# Altium schematic sheet VCU-S02-V00-12VProtection.schdoc
size A3; SheetNumber: 2; SheetTotal: 25
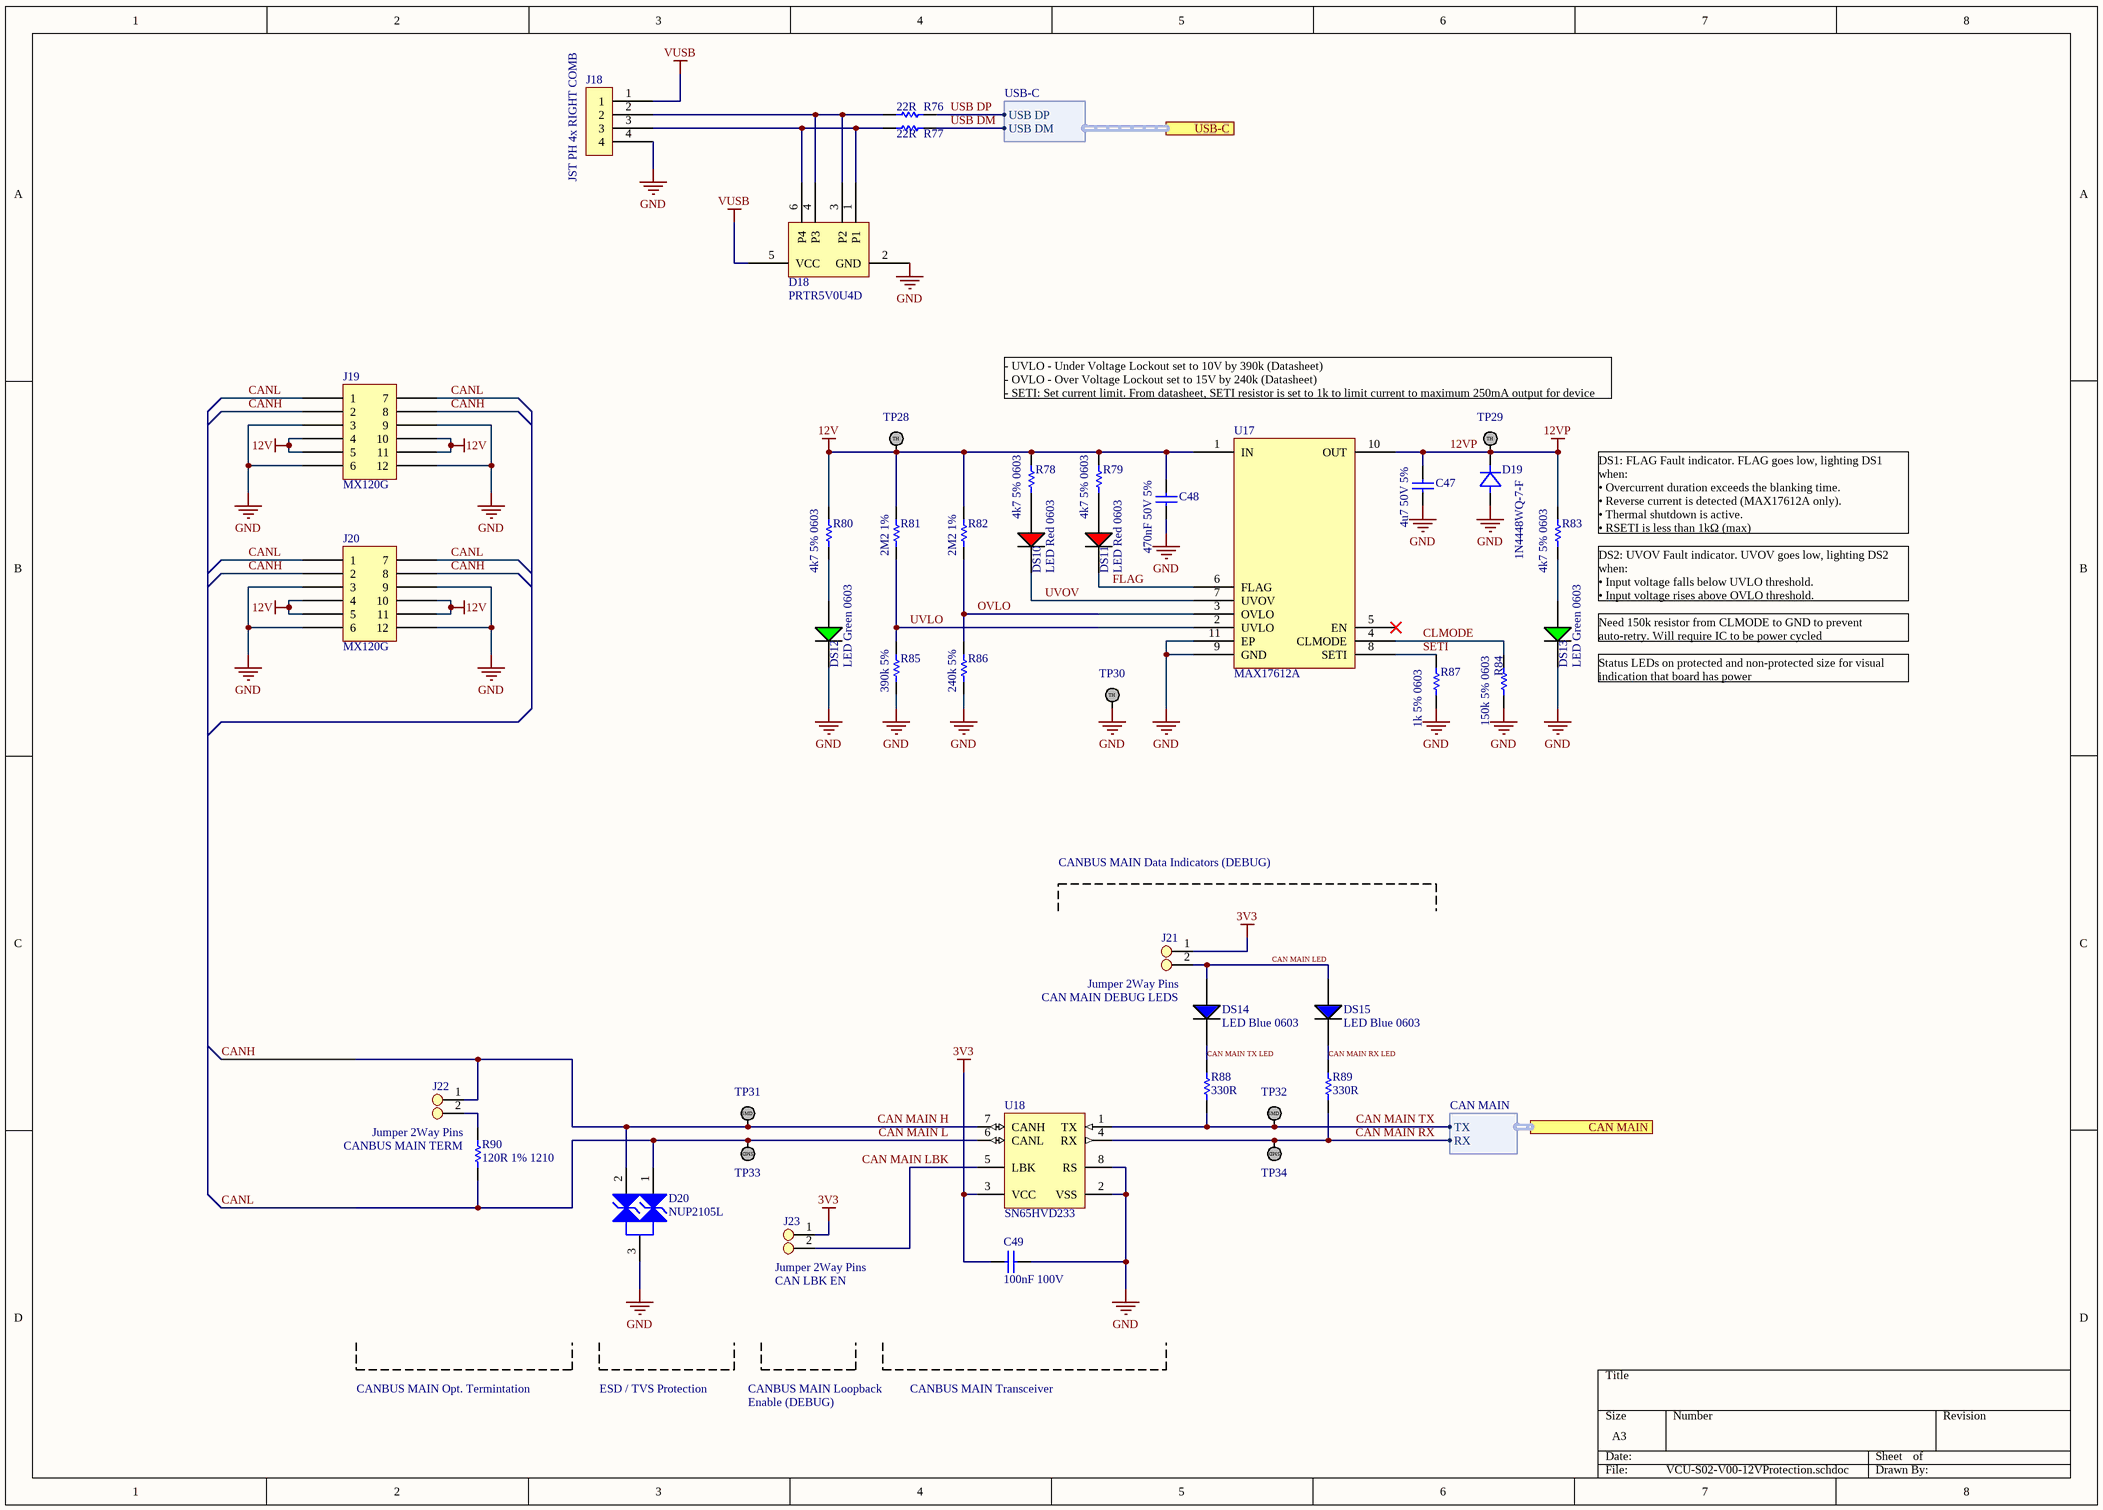
[diagram p0: VCU-S02-V00-12VProtection.schdoc]

## Parts
C47  4u7 50V 5%  [Cap_Ceramic_0603]
C48  470nF 50V 5%  [Cap_Ceramic_0603]
C49  100nF 100V  [Cap_Ceramic_0603]
D18  PRTR5V0U4D  [SC-47]
D19  1N4448WQ-7-F  [SMA]
D20  NUP2105L  [NUP2105L]
DS10  LED Red 0603  [LED RED 0603]
DS11  LED Red 0603  [LED RED 0603]
DS12  LED Green 0603  [LED GREEN 0603]
DS13  LED Green 0603  [LED GREEN 0603]
DS14  LED Blue 0603  [LED BLUE 0603]
DS15  LED Blue 0603  [LED BLUE 0603]
J18  JST PH 4x RIGHT COMB  [JST PH 4x RIGHT COMB]
J19  MX120G  [MX120G]
J20  MX120G  [MX120G]
J21  Jumper 2Way Pins  [Jumper_2Way_Pin]
J22  Jumper 2Way Pins  [Jumper_2Way_Pin]
J23  Jumper 2Way Pins  [Jumper_2Way_Pin]
R76  22R  [Res_ThinFilm_1210]
R77  22R  [Res_ThinFilm_1210]
R78  4k7 5% 0603  [Res_ThinFilm_0603]
R79  4k7 5% 0603  [Res_ThinFilm_0603]
R80  4k7 5% 0603  [Res_ThinFilm_0603]
R81  2M2 1%  [Res_ThinFilm_0603]
R82  2M2 1%  [Res_ThinFilm_0603]
R83  4k7 5% 0603  [Res_ThinFilm_0603]
R84  150k 5% 0603  [Res_ThinFilm_0603]
R85  390k 5%  [Res_ThinFilm_0603]
R86  240k 5%  [Res_ThinFilm_0603]
R87  1k 5% 0603  [Res_ThinFilm_0603]
R88  330R  [Res_ThinFilm_0603]
R89  330R  [Res_ThinFilm_0603]
R90  120R 1% 1210  [Res_ThinFilm_1210]
TP28  TestPoint  [TestPoint]  (value not drawn)
TP29  TestPoint  [TestPoint]  (value not drawn)
TP30  TestPoint  [TestPoint]  (value not drawn)
TP31  TestPoint_SMD  [TestPointSMD]  (value not drawn)
TP32  TestPoint_SMD  [TestPointSMD]  (value not drawn)
TP33  TestPoint_SMD  [TestPointSMD]  (value not drawn)
TP34  TestPoint_SMD  [TestPointSMD]  (value not drawn)
U17  MAX17612A  [10-Pin TDFN EP]
U18  SN65HVD233  [SN65HVD233DR]

## Ports
CAN MAIN (harness CAN MAIN), USB-C (harness USB-C)

## Harnesses
USB-C: USB DP, USB DM
CAN MAIN: RX, TX

## Nets
3V3: C49.2 J21.1 J23.1 U18.3(VCC)
12V: C48.2 J19.4 J19.5 J19.10 J19.11 J20.4 J20.5 J20.10 J20.11 R78.2 R79.2 R80.2 R81.2 R82.2 TP28.1 U17.1(IN)
12VP: C47.2 D19.K(Cathode) R83.2 TP29.1 U17.10(OUT)
GND: C47.1 C48.1 C49.1 D18.2(GND) D19.A(Anode) D20.3 DS12.2(C) DS13.2(C) J18.4 J19.3 J19.6 J19.9 J19.12 J20.3 J20.6 J20.9 J20.12 R84.1 R85.1 R86.1 R87.1 TP30.1 U17.9(GND) U17.11(EP) U18.2(VSS) U18.8(RS)
VUSB: D18.5(VCC) J18.1
CAN MAIN H: D20.2 J19.2 J19.8 J20.2 J20.8 J22.1 TP31.1 U18.7(CANH)  [also labelled CANH]
CAN MAIN L: D20.1 J19.1 J19.7 J20.1 J20.7 R90.1 TP33.1 U18.6(CANL)  [also labelled CANL]
CAN MAIN LBK: J23.2 U18.5(LBK)
CAN MAIN LED: DS14.1(A) DS15.1(A) J21.2
CAN MAIN RX: R89.1 TP34.1 U18.4(RX) ; port CAN MAIN.RX
CAN MAIN RX LED: DS15.2(C) R89.2
CAN MAIN TX: R88.1 TP32.1 U18.1(TX) ; port CAN MAIN.TX
CAN MAIN TX LED: DS14.2(C) R88.2
CLMODE: R84.2 U17.4(CLMODE)
FLAG: DS11.2(C) U17.6(FLAG)
OVLO: R82.1 R86.2 U17.3(OVLO)
SETI: R87.2 U17.8(SETI)
USB DM: R77.2 ; port USB-C.USB DM
USB DP: R76.2 ; port USB-C.USB DP
UVLO: R81.1 R85.2 U17.2(UVLO)
UVOV: DS10.2(C) U17.7(UVOV)
NetD18_1: D18.1(P1) D18.6(P4) J18.3 R77.1
NetD18_3: D18.3(P2) D18.4(P3) J18.2 R76.1
NetDS10_1: DS10.1(A) R78.1
NetDS11_1: DS11.1(A) R79.1
NetDS12_1: DS12.1(A) R80.1
NetDS13_1: DS13.1(A) R83.1
NetJ22_2: J22.2 R90.2

Not connected (* = marked no-connect by the designer): U17 5(EN)*

## Notes on the sheet
- - UVLO - Under Voltage Lockout set to 10V by 390k (Datasheet)
  - OVLO - Over Voltage Lockout set to 15V by 240k (Datasheet)
  - SETI: Set current limit. From datasheet, SETI resistor is set to 1k to limit current to maximum 250mA output for device
- (near R83) DS1: FLAG Fault indicator. FLAG goes low, lighting DS1 when:
  • Overcurrent duration exceeds the blanking time.
  • Reverse current is detected (MAX17612A only).
  • Thermal shutdown is active.
  • RSETI is less than 1kΩ (max)
- DS2: UVOV Fault indicator. UVOV goes low, lighting DS2 when:
  • Input voltage falls below UVLO threshold.
  • Input voltage rises above OVLO threshold.
- (near DS13) Need 150k resistor from CLMODE to GND to prevent auto-retry. Will require IC to be power cycled
- (near DS13) Status LEDs on protected and non-protected size for visual indication that board has power
- CANBUS MAIN Data Indicators (DEBUG)
- CAN MAIN DEBUG LEDS
- (near R90) CANBUS MAIN TERM
- (near J23) CAN LBK EN
- CANBUS MAIN Opt. Termintation
- ESD / TVS Protection
- CANBUS MAIN Loopback
- CANBUS MAIN Transceiver
- Enable (DEBUG)
- (in symbol TestPoint) TH
- (in symbol TestPoint_SMD) SMD

## Library data of the parts
C47 = 4u7 50V 5% X7R 0603: Capacitor, Ceramic, SMD, 4u7, 50V, 5%, X7R, 0603
C48 = 470nF 50V 5% X7R 0603: Capacitor, Ceramic, SMD, 470nF, 50V, 5%, X7R, 0603
C49 = 100nF 100V 5% X7R 0603: Capacitor, Ceramic, SMD, 100nF, 100V, 5%, X7R, 0603
D18 = PRTR5V0U4D: Clamp Ipp Tvs Diode Surface Mount 6-TSOP
D19 = 1N4448WQ-7-F: Diode, SMD, 75V, 5%, 250mA, SOD123; Manufacturer: ON Semiconductor / Fairchild; Manufacturer Part Number: 1N914BWS; Average Rectified Current: 150mA; Element Configuration: Single; Forward Voltage: 1V; Max Reverse Leakage Current: 5uA; Power Dissipation: 200mW; Recovery Time: 4ns; Max Forward Surge Current (Ifsm): 4A; Parameter 1: *; Weight: 0.0276g; Category: Rectifier Diodes; Contact Plating: Tin,Matte; Forward Current: 150mA; Lead Free: Lead Free; Max Operating Temperature: 150°C; Max Repetitive Reverse Voltage (Vrrm): 75V; Max Reverse Voltage (DC): 75V; Min Operating Temperature: -55°C; Mount: Surface Mount; Number of Pins: 2; Package Quantity: 1; Packaging: Tape and Reel; Peak Reverse Current: 5uA; Radiation Hardening: No; REACH SVHC: No SVHC; Reverse Recovery Time: 4ns; Height: 1mm; Length: 1.8mm; Reverse Voltage: 75V; Width: 1.35mm
J19 J20 = MX120G: MX120G with standard connector layout
J21-J23 = Jumper 2Way Side Pins
R76 R77 R90 = 120R 1% 1210: Resistor, SMD, 120R, 0.25W, 1%, 1210
R78-R80 R83 = 4k7 5% 0603: Resistor, SMD, 4k7, 0.1W, 5%, 0603
R81 R82 = 2M2 1% 0603: Resistor, SMD, 2M2, 0.125W, 1%, 0603
R84 = 150k 5%, 0603: Resistor, SMD, 150k, 0.1W, 5%, 0603
R85 = 390k 5% 0603: Resistor, SMD, 390k, 0.1W, 5%, 0603
R86 = 240k 5% 0603: Resistor, SMD, 240k, 0.1W, 5%, 0603
R87 = 1k 5% 0603: Resistor, SMD, 1k, 0.1W, 5%, 0603
R88 R89 = 330R 5% 0603: Resistor, SMD, 330R, 0.1W, 5%, 0603
U17 = MAX17612A: 4.5V to 60V, 250mA Current-Limiter with OV, UV, and Reverse Protection; ComponentLink1Description: Datasheet; ComponentLink1URL: https://datasheets.maximintegrated.com/en/ds/MAX17612A-MAX17612C.pdf
D20 = NUP2105L: ComponentLink1Description: Datasheet; ComponentLink1URL: https://www.onsemi.cn/PowerSolutions/document/NUP2105L-D.PDF; Parameter 1: *; ComponentLink2Description: LCSC; ComponentLink2URL: https://lcsc.com/product-detail/TVS_ON-Semiconductor-NUP2105LT1G_C14486.html; ComponentLink3Description: Digikey; ComponentLink3URL: https://www.digikey.com.au/product-detail/en/on-semiconductor/SZNUP2105LT1G/SZNUP2105LT1GOSCT-ND/3487669
U18 = SN65HVD233: ComponentLink1Description: LCSC; ComponentLink1URL: https://lcsc.com/product-detail/CAN-ICs_Texas-Instruments_SN65HVD233DRG4_Texas-Instruments-Texas-Instruments-SN65HVD233DRG4_C61643.html; ComponentLink2Description: Digikey; ComponentLink2URL: https://www.digikey.com.au/product-detail/en/texas-instruments/SN65HVD233DR/296-35967-1-ND/4134960; ComponentLink3Description: Datasheet; ComponentLink3URL: https://www.ti.com/lit/ds/symlink/sn65hvd233.pdf?ts=1588560888178; ComponentLink4Description: Ti Product Page; ComponentLink4URL: https://www.ti.com/product/SN65HVD233